# EAGLE design AtmelSMD328NRF (EAGLE 7.1.0)
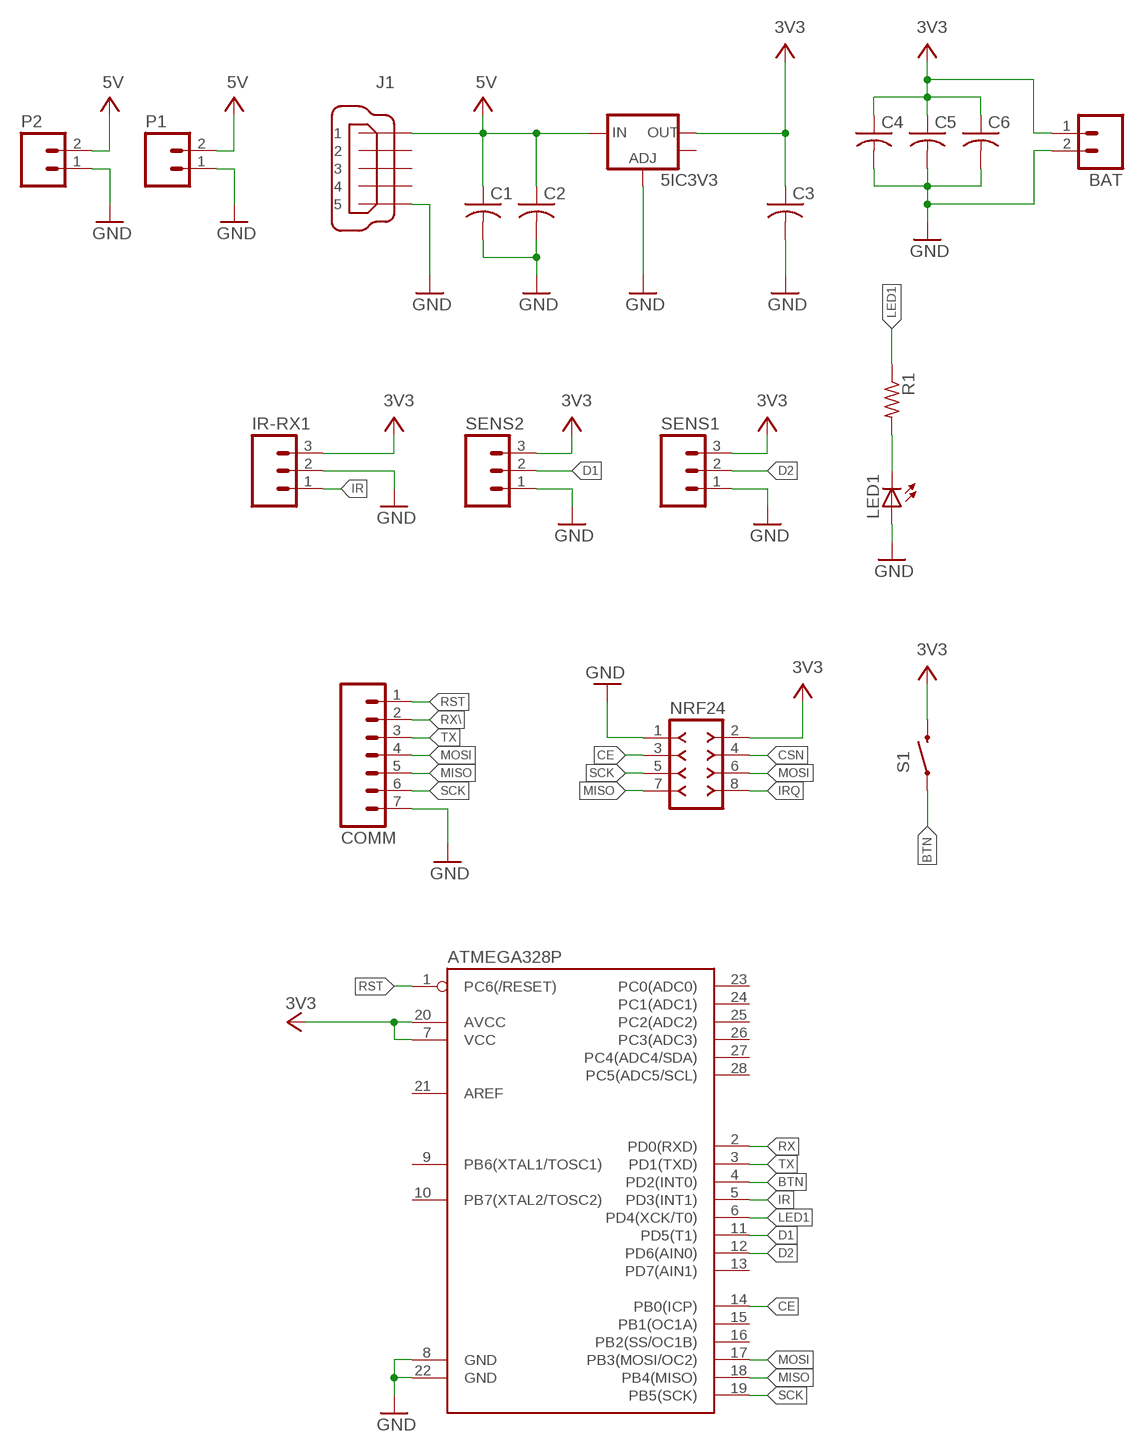
[diagram p0: schematic, sheet 1]

## Parts
5IC3V3  V_REG_LM1117SOT223  [SOT223]
ATMEGA328P  ATMEGA328P_PDIP  [DIL28-3]
BAT  M02PTH  [1X02]
C1  C-USC0805  [C0805]
C2  C-USC0805  [C0805]
C3  C-USC0805  [C0805]
C4  C-USC0805  [C0805]
C5  C-USC0805  [C0805]
C6  C-USC0805  [C0805]
COMM  M07  [1X07]
IR-RX1  M03PTH  [1X03]
J1  MICRO-USB-ZX62R-B-5P  [ZX62R-B-5P]
LED1  LEDCHIPLED_0805  [CHIPLED_0805]
NRF24  F-2X04-DIL-100  [DIL-100-2X04]
P1  M02PTH  [1X02]
P2  M02PTH  [1X02]
R1  R-US_R0805  [R0805]
S1  SWITCH-MOMENTARY-2SMD-1101NE  [TACTILE-SWITCH-1101NE]
SENS1  M03PTH  [1X03]
SENS2  M03PTH  [1X03]

## Nets
+3V3: 5IC3V3.2(OUT) ATMEGA328P.7(VCC) ATMEGA328P.20(AVCC) BAT.1 C3.1 C4.1 C5.1 C6.1 IR-RX1.3 NRF24.2 S1.2 SENS1.3 SENS2.3 ; supply symbol labelled 3V3
+5V: 5IC3V3.3(IN) C1.1 C2.1 J1.1 P1.2 P2.2 ; supply symbol labelled 5V
BTN: ATMEGA328P.4(PD2(INT0)) S1.1
CE: ATMEGA328P.14(PB0(ICP)) NRF24.3
CSN: NRF24.4
D1: ATMEGA328P.11(PD5(T1)) SENS2.2
D2: ATMEGA328P.12(PD6(AIN0)) SENS1.2
GND: 5IC3V3.1(ADJ) ATMEGA328P.8(GND) ATMEGA328P.22(GND) BAT.2 C1.2 C2.2 C3.2 C4.2 C5.2 C6.2 COMM.7 IR-RX1.2 J1.5 LED1.A NRF24.1 P1.1 P2.1 SENS1.1 SENS2.1
IR: ATMEGA328P.5(PD3(INT1)) IR-RX1.1
IRQ: NRF24.8
LED1: ATMEGA328P.6(PD4(XCK/T0)) R1.1
MISO: ATMEGA328P.18(PB4(MISO)) COMM.5 NRF24.7
MOSI: ATMEGA328P.17(PB3(MOSI/OC2)) COMM.4 NRF24.6
N$9: LED1.C R1.2
RST: ATMEGA328P.1(PC6(/RESET)) COMM.1
RX: ATMEGA328P.2(PD0(RXD))
RX\: COMM.2
SCK: ATMEGA328P.19(PB5(SCK)) COMM.6 NRF24.5
TX: ATMEGA328P.3(PD1(TXD)) COMM.3
Unconnected: 5IC3V3.4(OUT) ATMEGA328P.9(PB6(XTAL1/TOSC1)) ATMEGA328P.10(PB7(XTAL2/TOSC2)) ATMEGA328P.13(PD7(AIN1)) ATMEGA328P.15(PB1(OC1A)) ATMEGA328P.16(PB2(SS/OC1B)) ATMEGA328P.21(AREF) ATMEGA328P.23(PC0(ADC0)) ATMEGA328P.24(PC1(ADC1)) ATMEGA328P.25(PC2(ADC2)) ATMEGA328P.26(PC3(ADC3)) ATMEGA328P.27(PC4(ADC4/SDA)) ATMEGA328P.28(PC5(ADC5/SCL)) J1.2 J1.3 J1.4

## Library data of the parts
5IC3V3 = sparkFun-PowerIC:V_REG_LM1117: Voltage Regulator LM1117 Standard adjustable voltage regulator but in SMD form. Spark Fun Electronics SKU : COM-00595; PROD_ID: VREG-08170
ATMEGA328P = sparkFun-DigitalIC:ATMEGA328P_PDIP: uC used in the Arduino 32kb flash, 1k EEPROM, 2k SRAM This is the through-hole version of this chip.
BAT P1 P2 = sparkFun-Connectors:M02: Standard 2-pin 0.1" header. Use with - straight break away headers ( PRT-00116) - right angle break away headers (PRT-00553) - swiss pins (PRT-00743) - machine pins (PRT-00117) - female headers (PRT-00115) Molex polarized connector foot print use with: PRT-08233 with associated crimp pins and housings. 2.54_SCREWTERM for use with PRT-10571. 3.5mm Screw Terminal footprints for PRT-08084 5mm Screw Terminal footprints for use with PRT-08432
C1-C6 = resistor:C-US: CAPACITOR, American symbol
COMM = sparkFun-Connectors:M07: Header 7 Standard 7-pin 0.1" header. Use with straight break away headers (SKU : PRT-00116), right angle break away headers (PRT-00553), swiss pins (PRT-00743), machine pins (PRT-00117), and female headers (PRT-00115). NOTES ON THE VARIANTS LOCK and LOCK_LONGPADS... This footprint was designed to help hold the alignment of a through-hole component (i.e. 7-pin header) while soldering it into place. You may notice that each hole has been shifted either up or down by 0.005 of an inch from it's more standard position (which is usually a perfectly straight line). This slight alteration caused the pins (the squares in the middle) to touch the edges of the holes. Because they are alternating, it causes a "brace" to hold the header in place. 0.005 has proven to be the perfect amount of "off-center" position when using our standard breakaway headers. Although looks a little odd when you look at the bare footprint, once you have a header in there, the alteration is very hard to notice. Also, if you push a header all the way into place, it is covered up entirely on the bottom side. This idea of altering the position of holes to aid alignment will be further integrated into the Sparkfun Library for other footprints. It can help hold any component with 3 or more connection pins.
IR-RX1 SENS1 SENS2 = sparkFun-Connectors:M03: Header 3 Standard 3-pin 0.1" header. Use with straight break away headers (SKU : PRT-00116), right angle break away headers (PRT-00553), swiss pins (PRT-00743), machine pins (PRT-00117), and female headers (PRT-00115). Molex polarized connector foot print use with SKU : PRT-08232 with associated crimp pins and housings.
J1 = con-hirose2:MICRO-USB-: Hirose Micro USB Connector ZX62R-B-5P: Micro B, reverse (top mount) shell SMT Supplier: DigiKey H11574CT-ND Source: http://www.hirose.co.jp/cataloge_hp/e24200011.pdf
LED1 = adafruit:LED: LED OSRAM: - CHIPLED LG R971, LG N971, LY N971, LG Q971, LY Q971, LO R971, LY R971 LH N974, LH R974 LS Q976, LO Q976, LY Q976 LO Q996 - Hyper CHIPLED LW Q18S LB Q993, LB Q99A, LB R99A - SideLED LS A670, LO A670, LY A670, LG A670, LP A670 LB A673, LV A673, LT A673, LW A673 LH A674 LY A675 LS A676, LA A676, LO A676, LY A676, LW A676 LS A679, LY A679, LG A679 - Hyper Micro SIDELED� LS Y876, LA Y876, LO Y876, LY Y876 LT Y87S - SmartLED LW L88C, LW L88S LB L89C, LB L89S, LG L890 LS L89K, LO L89K, LY L89K LS L896, LA L896, LO L896, LY L896 - TOPLED LS T670, LO T670, LY T670, LG T670, LP T670 LSG T670, LSP T670, LSY T670, LOP T670, LYG T670 LG T671, LOG T671, LSG T671 LB T673, LV T673, LT T673, LW T673 LH T674 LS T676, LA T676, LO T676, LY T676, LB T676, LH T676, LSB T676, LW T676 LB T67C, LV T67C, LT T67C, LS T67K, LO T67K, LY T67K, LW E67C LS E67B, LA E67B, LO E67B, LY E67B, LB E67C, LV E67C, LT E67C LW T67C LS T679, LY T679, LG T679 LS T770, LO T770, LY T770, LG T770, LP T770 LB T773, LV T773, LT T773, LW T773 LH T774 LS E675, LA E675, LY E675, LS T675 LS T776, LA T776, LO T776, LY T776, LB T776 LHGB T686 LT T68C, LB T68C - Hyper Mini TOPLED� LB M676 - Mini TOPLED Santana� LG M470 LS M47K, LO M47K, LY M47K Source: http://www.osram.convergy.de/
NRF24 = con-headers-jp:F-2X04-: FEMALE HEADER
R1 = resistor:R-US_: RESISTOR, American symbol
S1 = sparkFun-Electromechanical:SWITCH-MOMENTARY-2: Various NO switches- pushbuttons, reed, etc; PROD_ID: SWCH-00815

## Board
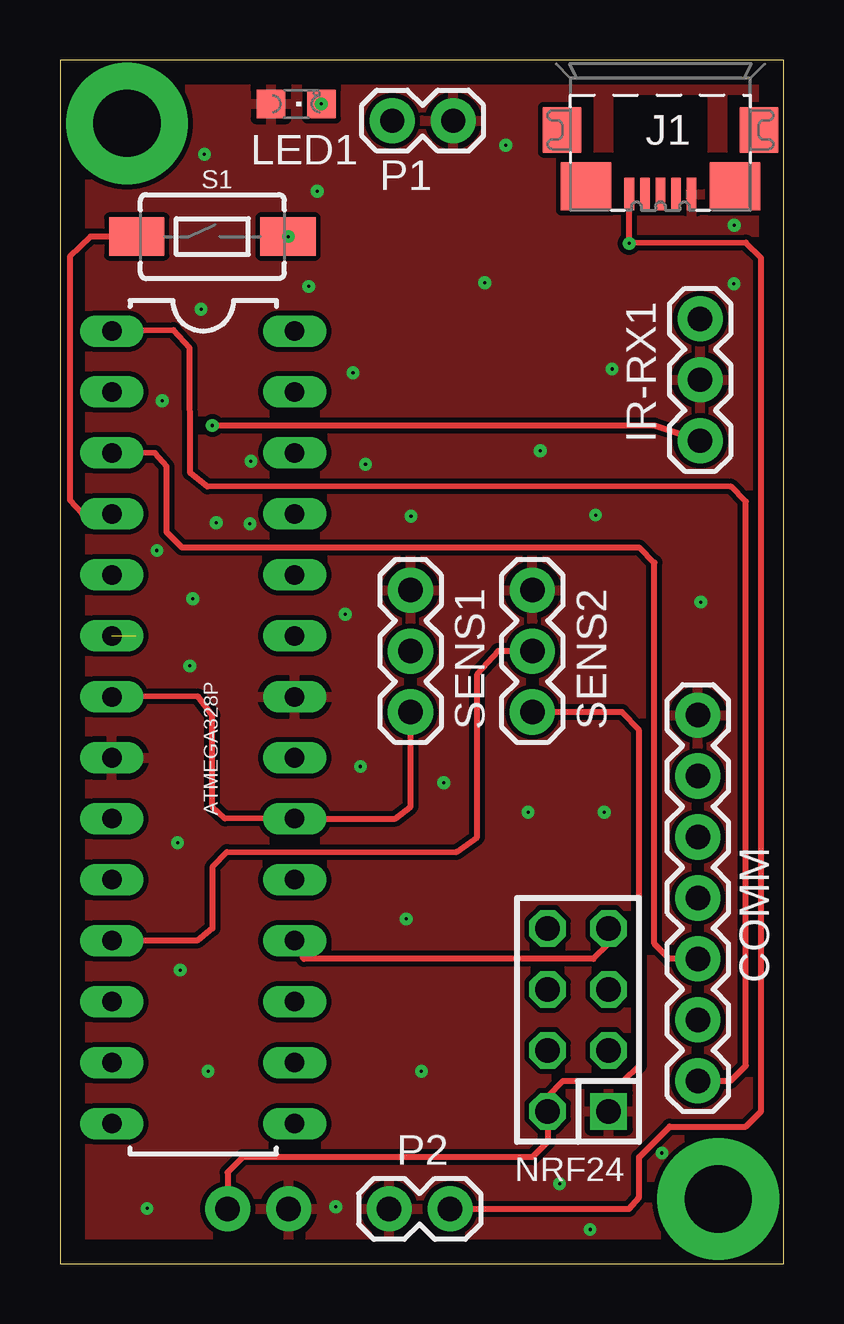
[diagram p1: board, top side]
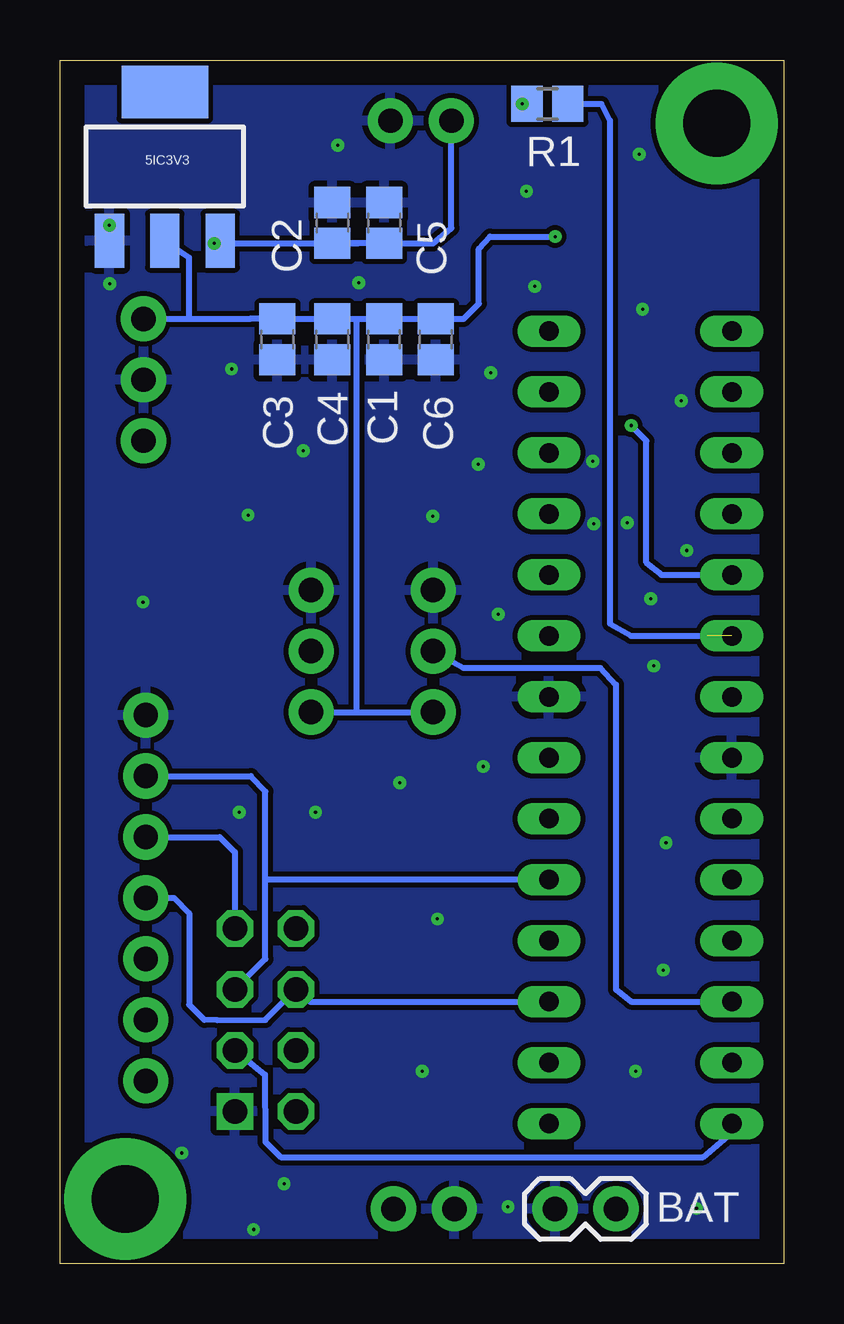
[diagram p2: board, bottom side, seen from below]

Size 30.15 x 50.16 mm. Coordinates in mm from the lower left corner, seen from the top.
Outline: 0,0 30.15,0 30.15,50.16 0,50.16 0,0
Copper layers (1*16): Top 0.035mm / dielectric 1.5mm / Bottom 0.035mm
Design rules "default": minimum track width 10mil, minimum drill 24mil, track to track 8mil, track to pad 8mil, pad to pad 8mil, via to via 8mil, smd to smd 8mil, copper to edge 40mil, drill to drill 8mil, minimum pad ring 10mil, minimum via ring 8mil, stop-mask expansion 4mil, vias tented up to drill 0mil, thermal gap 10mil

### Footprints (pad centres in the part's own frame; a part is rotated, then mirrored left to right if it is on the bottom)
SOT223 = smd 1.219 x 2.235: 1 -2.311,-3.099; 2 0,-3.099; 3 2.311,-3.099 | smd 3.6 x 2.2: 4 0,3.099
DIL28-3 = drill 0.813 long: 1 -16.51,-3.81; 2 -13.97,-3.81; 3 -11.43,-3.81; 4 -8.89,-3.81; 5 -6.35,-3.81; 6 -3.81,-3.81; 7 -1.27,-3.81; 8 1.27,-3.81; 9 3.81,-3.81; 10 6.35,-3.81; 11 8.89,-3.81; 12 11.43,-3.81; 13 13.97,-3.81; 14 16.51,-3.81; 15 16.51,3.81; 16 13.97,3.81; 17 11.43,3.81; 18 8.89,3.81; 19 6.35,3.81; 20 3.81,3.81; 21 1.27,3.81; 22 -1.27,3.81; 23 -3.81,3.81; 24 -6.35,3.81; 25 -8.89,3.81; 26 -11.43,3.81; 27 -13.97,3.81; 28 -16.51,3.81
1X02 = drill 1.016 pad 1.88: 1 0,0; 2 2.54,0
C0805 = smd 1.3 x 1.5: 1 -0.85,0; 2 0.85,0
1X07 = drill 1.016 pad 1.88: 1 0,0; 2 2.54,0; 3 5.08,0; 4 7.62,0; 5 10.16,0; 6 12.7,0; 7 15.24,0
1X03 = drill 1.016 pad 1.88: 1 0,0; 2 2.54,0; 3 5.08,0
ZX62R-B-5P = smd 1.35 x 0.4: 1 2.675,-1.3; 2 2.675,-0.65; 3 2.675,0; 4 2.675,0.65; 5 2.675,1.3 | smd 1.9 x 1.6: M1 0,-4.1; M2 0,4.1 | smd 2 x 2.1: M3 2.35,3.1; M4 2.35,-3.1
CHIPLED_0805 = smd 1.2 x 1.2: A 0,-1.05; C 0,1.05
DIL-100-2X04 = drill 1.016 square: 1 -3.81,-1.27 | drill 1.016 octagon: 2 -3.81,1.27; 3 -1.27,-1.27; 4 -1.27,1.27; 5 1.27,-1.27; 6 1.27,1.27; 7 3.81,-1.27; 8 3.81,1.27
R0805 = smd 1.3 x 1.5: 1 -0.85,0; 2 0.85,0
TACTILE-SWITCH-1101NE = smd 2.3 x 1.6: 1 -3.15,0; 2 3.15,0

### Placement (x,y rotation side)
5IC3V3  25.78,45.72 0 bottom
ATMEGA328P  5.97,22.35 270 top
BAT  6.99,2.29 180 bottom
C1  16.64,43.37 90 bottom
C2  18.8,43.37 90 bottom
C3  21.09,38.52 270 bottom
C4  18.81,38.52 270 bottom
C5  16.65,38.52 270 bottom
C6  14.49,38.52 270 bottom
COMM  26.58,7.62 90 top
IR-RX1  26.67,34.29 90 top
J1  25.02,47.24 270 top
LED1  9.84,48.32 270 top
NRF24  21.59,10.16 90 top
P1  16.38,47.62 180 top
P2  13.72,2.29 0 top
R1  9.84,48.32 180 bottom
S1  6.35,42.8 0 top
SENS1  14.61,28.07 270 top
SENS2  19.68,28.07 270 top

### Tracks (layer width: path | path; a pad name or v marks a point on that pad's centre or on a via)
+3V3  (via drill 0.13)
  Top 0.254: v9.52,42.8 S1.2 | BAT.1 6.99,3.81 7.62,4.45 19.68,4.45 20.32,5.08 NRF24.2 20.32,6.99 20.95,7.62 23.5,7.62 24.13,8.26 24.13,22.23 23.41,22.99 SENS2.3 | ATMEGA328P.7 5.74,23.64 6.35,22.86 6.35,19.05 6.87,18.55 ATMEGA328P.20 13.97,18.54 14.61,19.05 SENS1.3
  Bottom 0.254: SENS2.3 17.78,22.99 | 17.78,22.99 SENS1.3 | 21.88,39.39 C3.1 | C3.1 C4.1 17.78,39.37 | 17.78,39.37 C5.1 C6.1 13.34,39.37 12.7,40.01 12.7,42.29 12.24,42.8 v9.52,42.8 | C3.1 22.24,39.37 24.78,39.37 | 5IC3V3.2 24.78,41.93 24.78,39.37 | IR-RX1.3 24.78,39.37 | 17.78,22.99 17.78,39.37
+5V  (via drill 0.13)
  Top 0.254: J1.1 v23.72,42.51 28.57,42.55 29.21,41.91 29.21,6.35 28.57,5.71 25.4,5.71 24.13,4.45 24.13,2.77 23.72,2.28 P2.2
  Bottom 0.254: 5IC3V3.3 v23.72,42.51 17.74,42.52 | 17.74,42.52 C1.1 14.61,42.52 13.84,43.15 P1.2 | 17.74,42.52 C2.1
BTN
  Top 0.254: S1.1 1.27,42.8 0.41,41.97 0.41,31.81 0.92,31.24 ATMEGA328P.4
CE
  Bottom 0.254: NRF24.3 21.62,7.88 21.59,5.08 20.95,4.45 3.35,4.45 2.19,5.43 ATMEGA328P.14
D1
  Top 0.254: SENS2.2 18.26,25.53 17.39,24.57 17.38,17.78 16.51,17.14 6.97,17.16 6.35,16.51 6.35,13.97 5.71,13.46 ATMEGA328P.11
D2
  Bottom 0.254: ATMEGA328P.12 6.35,10.92 6.99,11.43 6.99,24.13 7.63,24.83 13.35,24.83 SENS1.2
GND  (via drill 0.13)
  other vias: 28.09,43.28 28.08,40.83 4.26,35.96 12.21,37.12 17.7,40.88 5.53,27.7 19.5,18.81 14.42,14.37 5.01,12.24 15.06,8.02 6.17,8.02 4.9,17.54 4.04,29.72 7.96,33.44 7.92,30.83 10.37,40.72 20.01,33.87 26.69,27.57 11.49,2.37 22.09,1.43 25.08,4.61 14.62,31.14 12.73,33.32 22.31,31.19 18.57,46.61 20.82,3.33 6.02,46.22 22.68,18.81 23,37.28 15.99,20.04 12.52,20.72 11.88,27.07 10.72,44.69 5.41,24.91 6.51,30.87 5.88,39.76 3.63,2.3
  pour Bottom: -10.79,60.33 45.72,60.33 45.72,-16.51 -10.79,-16.51
  pour Top: -5.08,55.88 38.73,55.88 38.73,-7.62 -5.08,-7.62
IR  (via drill 0.13)
  Top 0.254: IR-RX1.1 24.77,34.92 v6.35,34.92
  Bottom 0.254: v6.35,34.92 5.71,34.29 5.71,29.21 5.08,28.7 ATMEGA328P.5
LED1  (1 unrouted)
  Bottom 0.254: R1.1 7.59,48.32 7.24,47.62 7.24,26.67 6.35,26.16 ATMEGA328P.6 | 3.4,26.16 3.17,26.16
MISO
  Top 0.254: ATMEGA328P.18 9.85,13.46 10.16,12.7 22.23,12.7 22.86,13.34 NRF24.7
  Bottom 0.254: COMM.5 23.5,17.78 22.86,17.14 NRF24.7
MOSI
  Bottom 0.254: ATMEGA328P.17 19.7,10.91 NRF24.6 21.59,10.16 23.6,10.15 24.13,10.16 24.77,10.79 24.77,14.61 25.4,15.24 COMM.4
N$1  (via drill 2.79 pad 5.08)
  other vias: 2.79,47.51
N$2  (via drill 2.79 pad 5.08)
  other vias: 27.43,2.7
N$9  (via drill 0.13)
  Top 0.254: LED1.C
  Bottom 0.254: R1.2 LED1.C
  other vias: 10.89,48.32
RST
  Top 0.254: COMM.1 27.94,7.62 28.57,8.26 28.57,31.75 27.94,32.38 6.15,32.38 5.42,32.97 5.4,38.15 4.72,38.9 ATMEGA328P.1
SCK
  Bottom 0.254: COMM.6 22.19,20.32 21.59,19.68 21.59,16 | NRF24.5 21.59,12.7 21.59,16 | ATMEGA328P.19 21.59,16
TX
  Top 0.254: COMM.3 25.38,12.7 24.77,13.34 24.77,29.21 24.13,29.84 5.08,29.84 4.45,30.48 4.45,33.22 3.96,33.78 ATMEGA328P.3